# EAGLE schematic schaltplan (EAGLE 7.4.0)
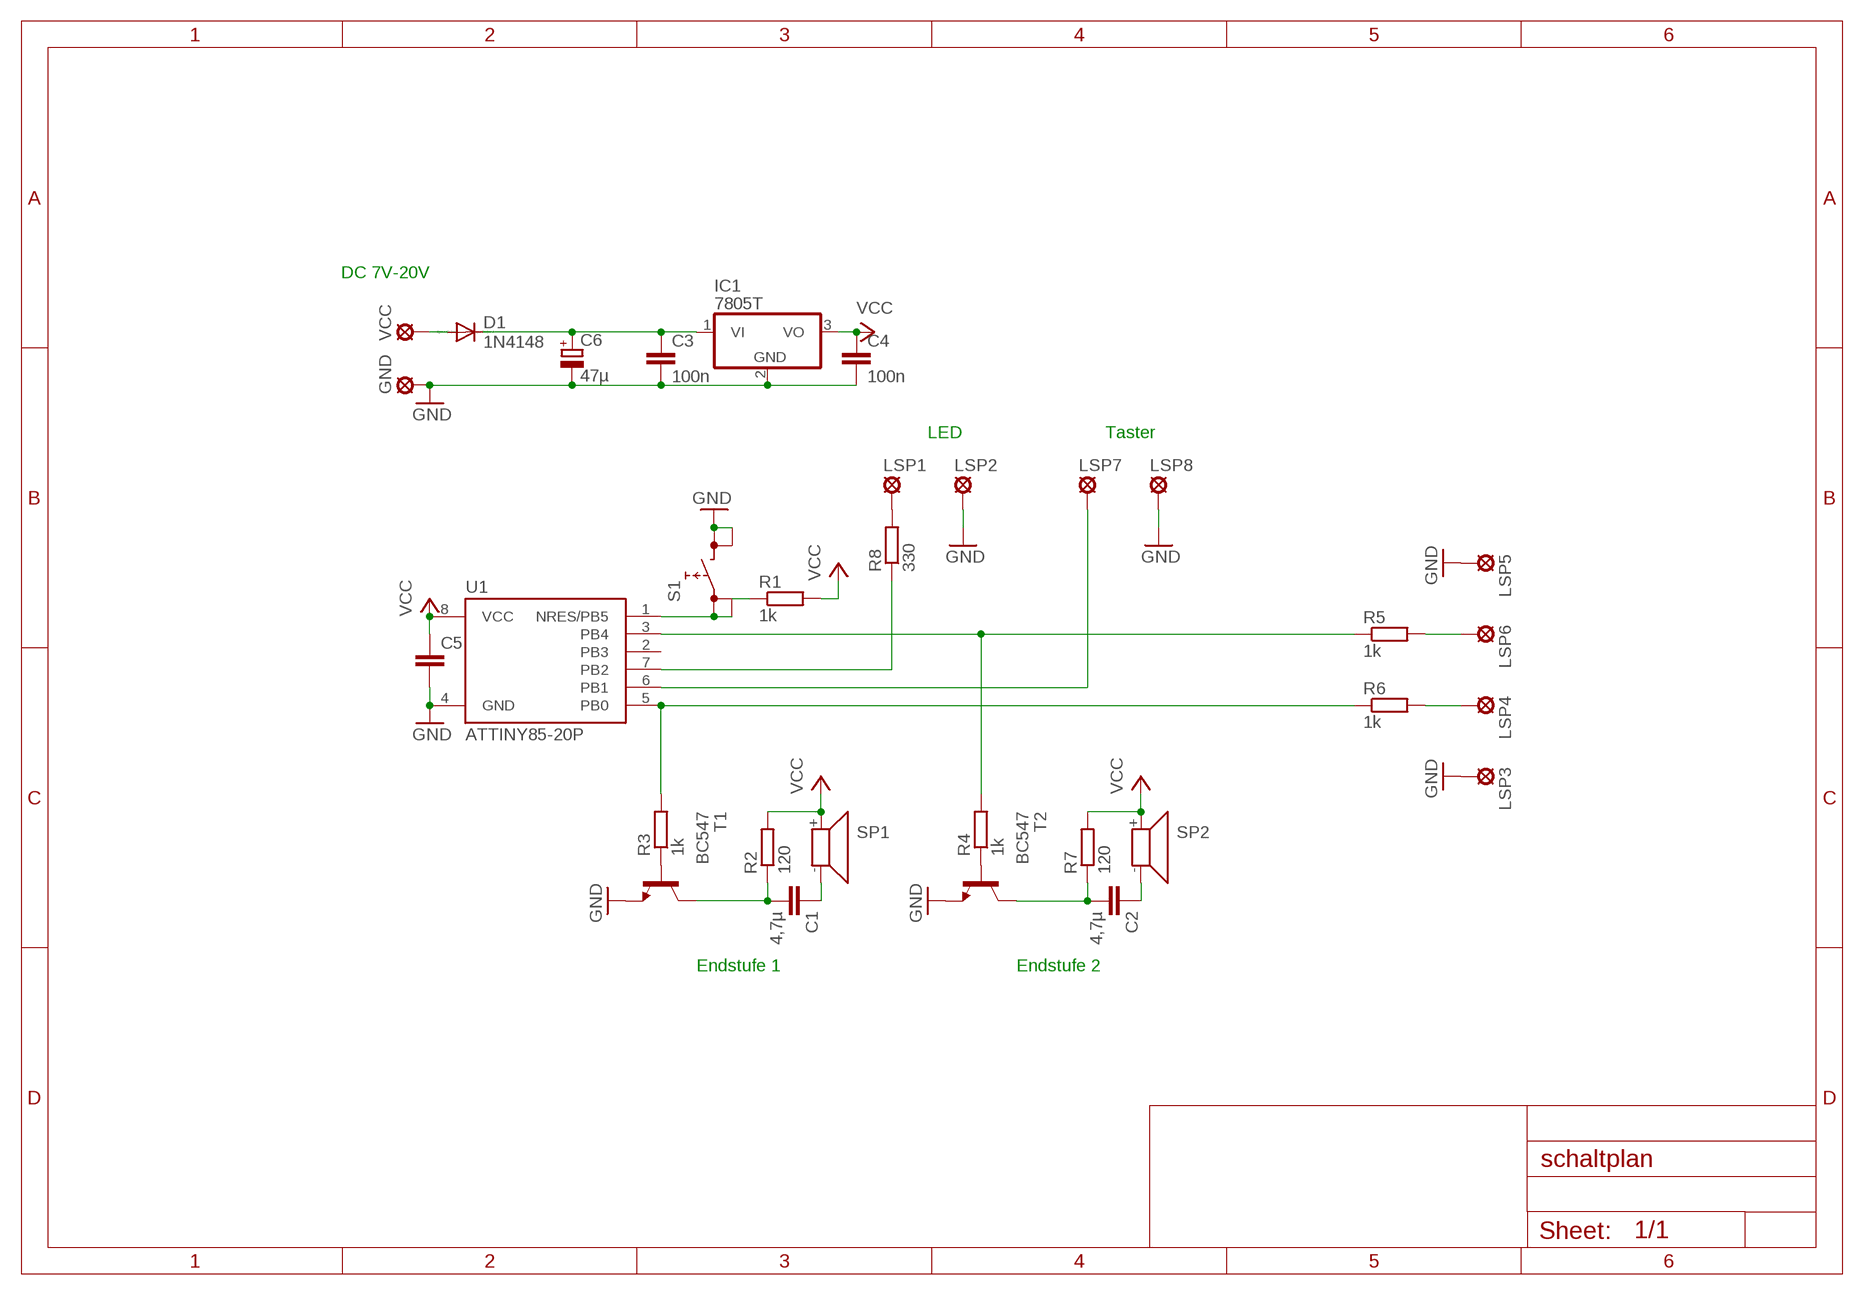
[diagram p0: schematic, sheet 1]

## Parts
C1  4,7µ  C5/3  [C5B3]
C2  4,7µ  C5/3  [C5B3]
C3  100n  C5/3  [C5B3]
C4  100n  C5/3  [C5B3]
C5  C5/3  [C5B3]
C6  47µ  CPOL-EUA/3216-18W  [A/3216-18W]
D1  1N4148  DIODE-D-12.5  [D-12.5]
GND  LSP10  [LSP10]
IC1  7805T  [TO220H]
LSP1  LSP10  [LSP10]
LSP2  LSP10  [LSP10]
LSP3  LSP10  [LSP10]
LSP4  LSP10  [LSP10]
LSP5  LSP10  [LSP10]
LSP6  LSP10  [LSP10]
LSP7  LSP10  [LSP10]
LSP8  LSP10  [LSP10]
R1  1k  R-EU_0204/7  [0204/7]
R2  120  R-EU_0204/7  [0204/7]
R3  1k  R-EU_0204/7  [0204/7]
R4  1k  R-EU_0204/7  [0204/7]
R5  1k  R-EU_0204/7  [0204/7]
R6  1k  R-EU_0204/7  [0204/7]
R7  120  R-EU_0204/7  [0204/7]
R8  330  R-EU_0204/7  [0204/7]
S1  REKN  [REKN]
SP1  SMS-1308MS-2-R  [SMS-1308MS-2-R]
SP2  SMS-1308MS-2-R  [SMS-1308MS-2-R]
T1  BC547  [TO92]
T2  BC547  [TO92]
U1  ATTINY85-20P  [PDIP08_300MIL]
VCC  LSP10  [LSP10]

## Nets
GND: C3.2 C4.2 C5.2 C6.- GND.MP IC1.2(GND) LSP2.MP LSP3.MP LSP5.MP LSP8.MP S1.1A S1.1B T1.1(E) T2.1(E) U1.4(GND)
N$1: D1.A VCC.MP
N$2: C3.1 C6.+ D1.C IC1.1(VI)
N$3: S1.0A S1.0B U1.1(NRES/PB5)
N$4: R3.2 R6.1 U1.5(PB0)
N$5: R4.1 T2.2(B)
N$6: R3.1 T1.2(B)
N$7: C1.2 R2.1 T1.3(C)
N$8: R4.2 R5.1 U1.3(PB4)
N$9: C1.1 SP1.-
N$10: R1.1
N$11: C2.2 R7.1 T2.3(C)
N$12: C2.1 SP2.-
N$13: LSP4.MP R6.2
N$14: LSP6.MP R5.2
N$15: LSP7.MP U1.6(PB1)
N$16: R8.1 U1.7(PB2)
N$17: LSP1.MP R8.2
VCC: C4.1 C5.1 IC1.3(VO) R1.2 R2.2 R7.2 SP1.+ SP2.+ U1.8(VCC)
Unconnected: U1.2(PB3)

## Notes on the sheet
- DC 7V-20V
- LED | Taster
- Endstufe 1 | Endstufe 2

## Library data of the parts
C1-C5 = capacitor-wima:C: CAPACITOR naming: grid - package width
C6 = rcl:CPOL-EU: POLARIZED CAPACITOR, European symbol
D1 = diode:DIODE-: DIODE
GND LSP1-LSP8 VCC = solpad:LSP10: SOLDER PAD drill 1.0 mm, distributor Buerklin, 12H555
IC1 = linear:78*: Positive VOLTAGE REGULATOR Source: http://cache.national.com/ds/LM/LM78L05.pdf http://www.fairchildsemi.com/ds/LM/LM7805.pdf
R1-R8 = rcl:R-EU_: RESISTOR, European symbol
S1 = switch:REKN: PUSH SWITCH ITT-Cannon-Cannon
SP1 SP2 = speaker:SMS-1308MS-2-R: Speaker 13 x 13mm, 8 Ohm, 0.7W Source: pui audio inc. SMS-1308MS-2-R.pdf
T1 T2 = transistor:BC547: NPN TRANSISTOR
U1 = _hhn_attiny25_45_85:ATTINY85*: ATMEL ATtiny 85 Packages: P = PDIP 08 30mil S = SOIC 08 EIAJ 208mil Technologies Note: for complete ordering code (temp. range, finish, tape&reel etc.) see www.atmel.com • Supply Voltage: V = (1.8…5.5)V | [blank] = (2.7…5.5)V • Speed: 10 = 10 MHz | 20 = 20 MHz Author: Dipl.-Ing. FH Rainer Bayer HHN Hochschule Heilbronn (Heilbronn University), rainer.bayer@hs-heilbronn.de Ingenieurbüro ing-rb, mail@ing-rb.de